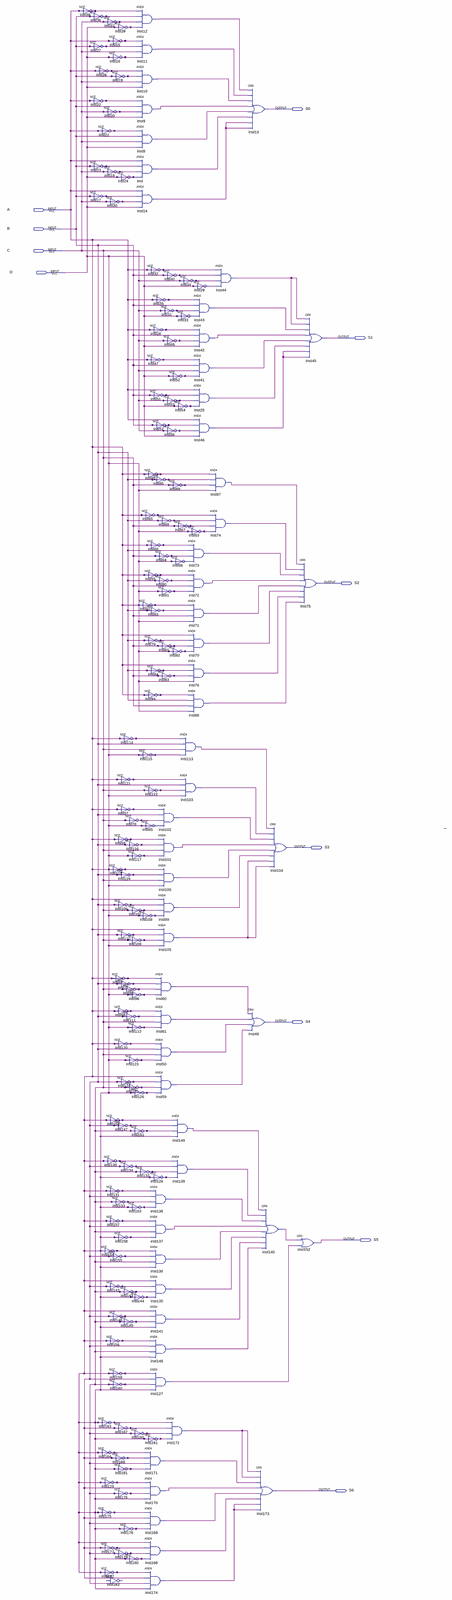
[diagram p0: schematic sheet, whole]
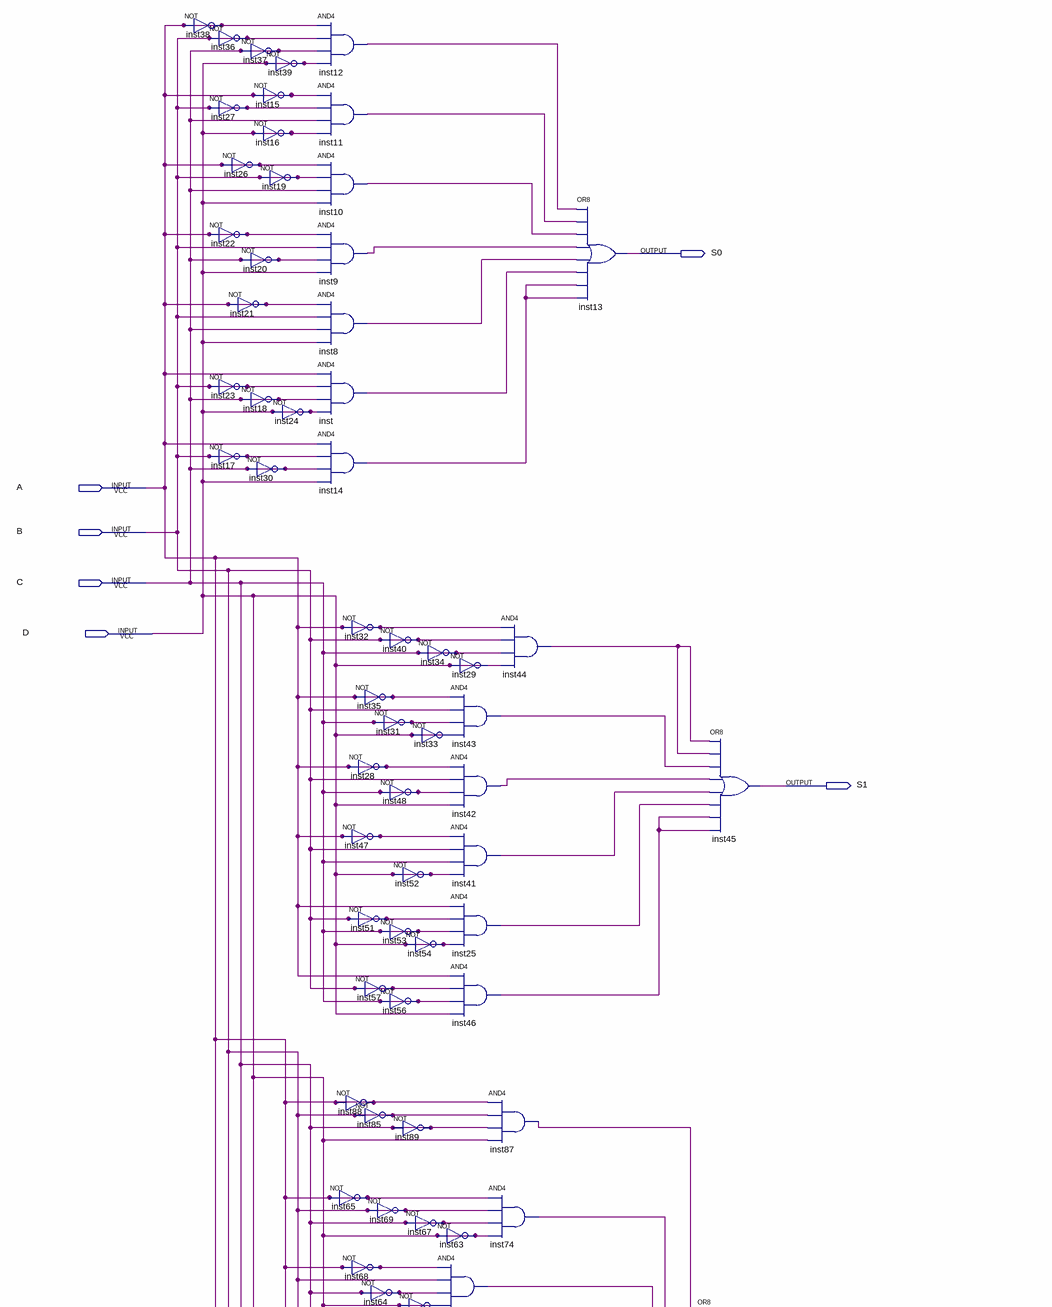
[diagram p1: schematic sheet, upper part]
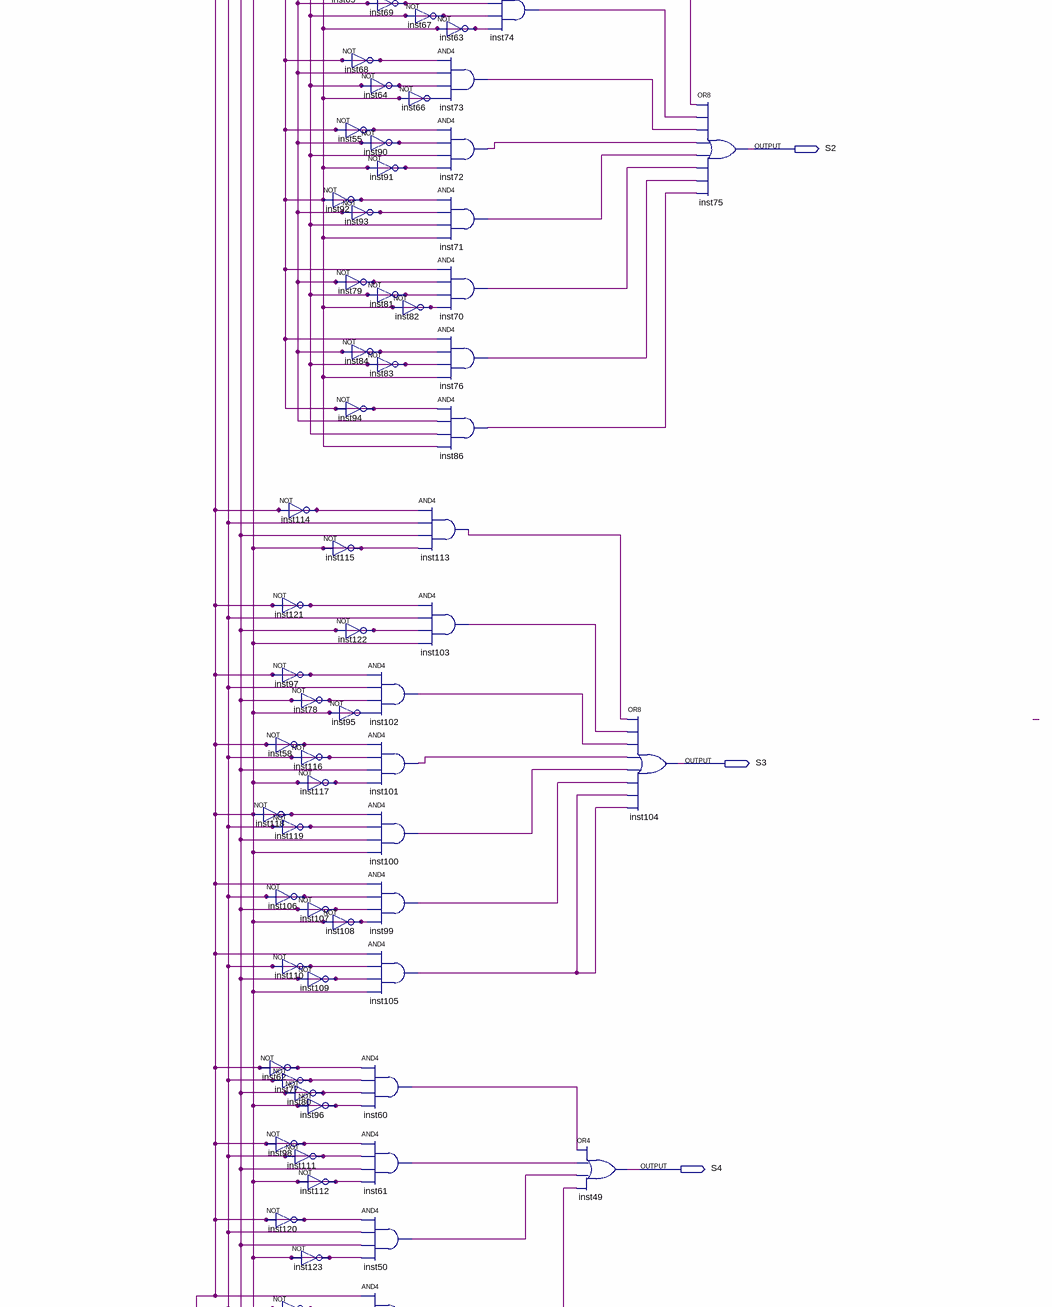
[diagram p2: schematic sheet, middle part]
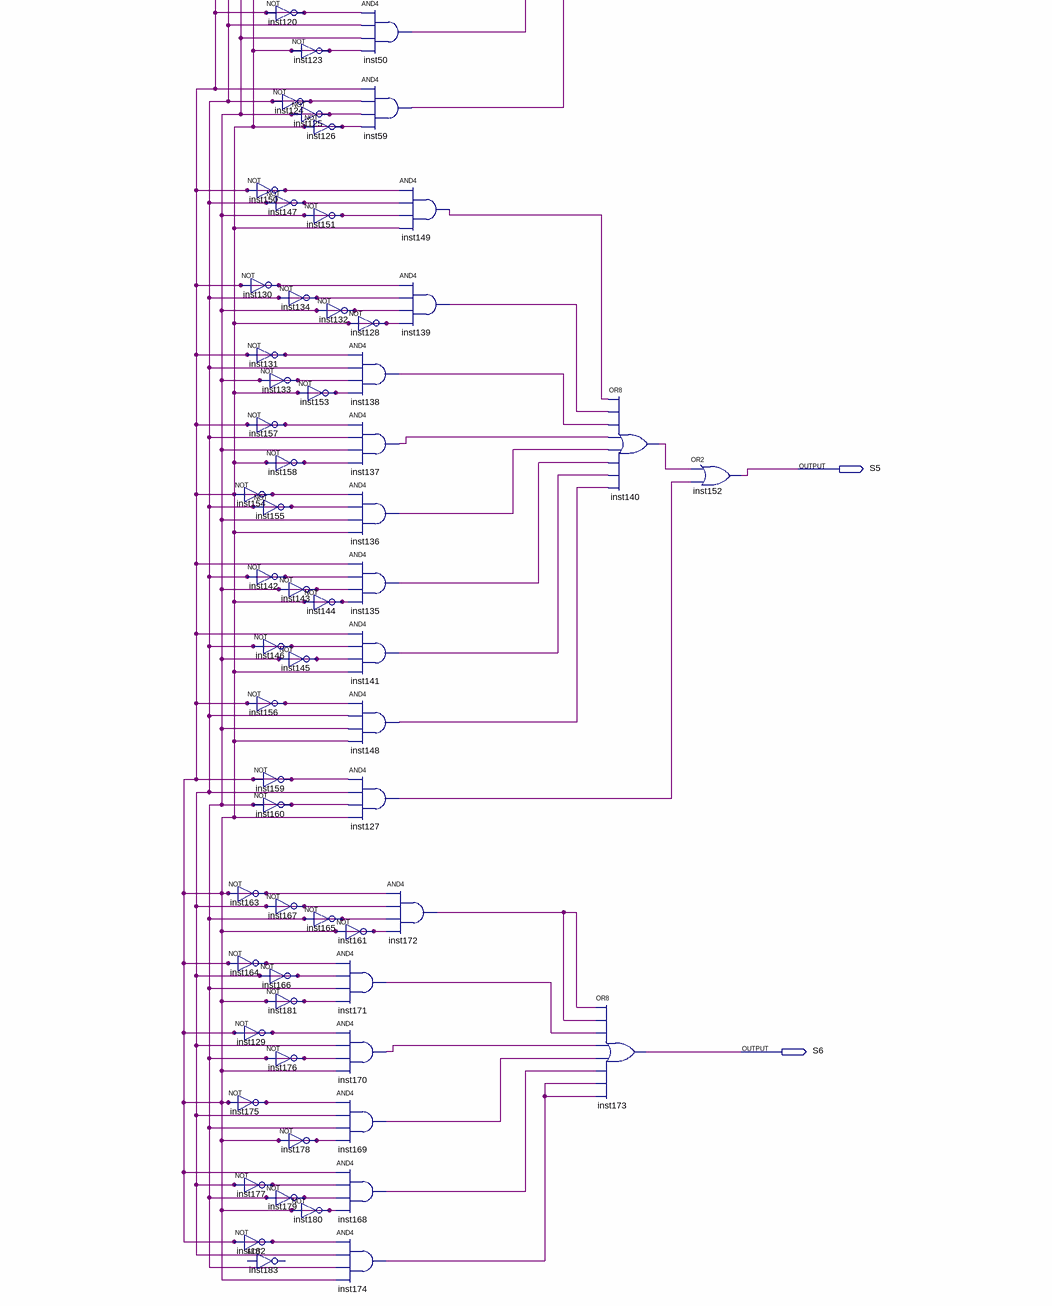
[diagram p3: schematic sheet, lower part]
// Quartus schematic Decodificador.bdf as structural Verilog: 176 symbols, 11 pins
module Decodificador (
  input  A,
  input  B,
  input  C,
  input  D,
  output S0,
  output S1,
  output S2,
  output S3,
  output S4,
  output S5,
  output S6
);

  wire inst8_out, inst9_out, inst10_out, inst11_out, inst12_out, inst14_out, inst25_out, inst41_out,
       inst42_out, inst43_out, inst44_out, inst46_out, inst50_out, inst59_out, inst60_out, inst61_out,
       inst70_out, inst71_out, inst72_out, inst73_out, inst74_out, inst76_out, inst86_out, inst87_out,
       inst99_out, inst100_out, inst101_out, inst102_out, inst103_out, inst105_out, inst113_out, inst127_out,
       inst135_out, inst136_out, inst137_out, inst138_out, inst139_out, inst140_out, inst141_out,
       inst148_out, inst149_out, inst168_out, inst169_out, inst170_out, inst171_out, inst172_out,
       inst174_out, inst_out;

  not inst38 (A, A);
  not inst36 (B, B);
  not inst27 (B, B);
  not inst22 (A, A);
  not inst23 (B, B);
  not inst17 (B, B);
  not inst37 (C, C);
  not inst39 (A, A);
  not inst15 (A, A);
  not inst16 (A, A);
  not inst26 (A, A);
  not inst19 (B, B);
  not inst20 (C, C);
  not inst21 (A, A);
  not inst18 (C, C);
  not inst30 (C, C);
  not inst58 (A, A);
  not inst118 (A, A);
  not inst106 (B, B);
  not inst62 (A, A);
  not inst98 (A, A);
  not inst120 (A, A);
  not inst150 (A, A);
  not inst147 (B, B);
  not inst130 (A, A);
  not inst131 (A, A);
  not inst133 (C, C);
  not inst157 (A, A);
  not inst158 (A, A);
  not inst154 (A, A);
  not inst155 (B, B);
  not inst142 (B, B);
  not inst146 (B, B);
  not inst156 (A, A);
  not inst159 (A, A);
  not inst160 (C, C);
  not inst163 (A, A);
  not inst167 (B, B);
  not inst164 (A, A);
  not inst166 (B, B);
  not inst181 (A, A);
  not inst129 (A, A);
  not inst176 (C, C);
  not inst175 (A, A);
  not inst177 (B, B);
  not inst179 (C, C);
  not inst182 (A, A);
  // NOT inst183 is placed but not wired
  and inst12 (inst12_out, A, B, C, A);
  and inst11 (inst11_out, A, B, C, A);
  and inst10 (inst10_out, A, B, C, A);
  and inst9 (inst9_out, A, B, C, A);
  and inst8 (inst8_out, A, B, C, A);
  and inst (inst_out, A, B, C, A);
  not inst24 (A, A);
  and inst14 (inst14_out, A, B, C, A);
  not inst114 (A, A);
  not inst121 (A, A);
  not inst97 (A, A);
  not inst78 (C, C);
  not inst116 (B, B);
  not inst117 (A, A);
  not inst119 (B, B);
  not inst107 (C, C);
  not inst110 (B, B);
  not inst109 (C, C);
  not inst77 (B, B);
  not inst80 (C, C);
  not inst96 (A, A);
  not inst111 (B, B);
  not inst112 (A, A);
  not inst123 (A, A);
  not inst124 (B, B);
  not inst125 (C, C);
  not inst126 (A, A);
  not inst151 (C, C);
  not inst134 (B, B);
  not inst132 (C, C);
  not inst153 (A, A);
  not inst143 (C, C);
  not inst144 (A, A);
  not inst145 (C, C);
  not inst165 (C, C);
  not inst178 (A, A);
  not inst180 (A, A);
  not inst32 (A, A);
  not inst35 (A, A);
  not inst28 (A, A);
  not inst47 (A, A);
  not inst51 (B, B);
  not inst57 (B, B);
  not inst88 (A, A);
  not inst85 (B, B);
  not inst65 (A, A);
  not inst69 (B, B);
  not inst68 (A, A);
  not inst64 (C, C);
  not inst55 (A, A);
  not inst90 (B, B);
  not inst91 (A, A);
  not inst92 (A, A);
  not inst93 (B, B);
  not inst79 (B, B);
  not inst81 (C, C);
  not inst84 (B, B);
  not inst83 (C, C);
  not inst94 (A, A);
  not inst115 (A, A);
  not inst122 (C, C);
  and inst102 (inst102_out, A, B, C, A);
  not inst95 (A, A);
  and inst101 (inst101_out, A, B, C, A);
  and inst100 (inst100_out, A, B, C, A);
  and inst99 (inst99_out, A, B, C, A);
  not inst108 (A, A);
  and inst105 (inst105_out, A, B, C, A);
  and inst60 (inst60_out, A, B, C, A);
  and inst61 (inst61_out, A, B, C, A);
  and inst50 (inst50_out, A, B, C, A);
  and inst59 (inst59_out, A, B, C, A);
  not inst128 (A, A);
  and inst138 (inst138_out, A, B, C, A);
  and inst137 (inst137_out, A, B, C, A);
  and inst136 (inst136_out, A, B, C, A);
  and inst135 (inst135_out, A, B, C, A);
  and inst141 (inst141_out, A, B, C, A);
  and inst148 (inst148_out, A, B, C, A);
  and inst127 (inst127_out, A, B, C, A);
  not inst161 (A, A);
  and inst171 (inst171_out, A, B, C, A);
  and inst170 (inst170_out, A, B, C, A);
  and inst169 (inst169_out, A, B, C, A);
  and inst168 (inst168_out, A, B, C, A);
  and inst174 (inst174_out, A, B, C, A);
  not inst40 (B, B);
  not inst34 (C, C);
  not inst31 (C, C);
  not inst33 (A, A);
  not inst48 (C, C);
  not inst52 (A, A);
  not inst53 (C, C);
  not inst54 (A, A);
  not inst56 (C, C);
  not inst89 (C, C);
  not inst67 (C, C);
  not inst66 (A, A);
  not inst82 (A, A);
  and inst113 (inst113_out, A, B, C, A);
  and inst103 (inst103_out, A, B, C, A);
  and inst149 (inst149_out, A, B, C, A);
  and inst139 (inst139_out, A, B, C, A);
  and inst172 (inst172_out, A, B, C, A);
  not inst29 (A, A);
  and inst43 (inst43_out, A, B, C, A);
  and inst42 (inst42_out, A, B, C, A);
  and inst41 (inst41_out, A, B, C, A);
  and inst25 (inst25_out, A, B, C, A);
  and inst46 (inst46_out, A, B, C, A);
  not inst63 (A, A);
  and inst73 (inst73_out, A, B, C, A);
  and inst72 (inst72_out, A, B, C, A);
  and inst71 (inst71_out, A, B, C, A);
  and inst70 (inst70_out, A, B, C, A);
  and inst76 (inst76_out, A, B, C, A);
  and inst86 (inst86_out, A, B, C, A);
  and inst44 (inst44_out, A, B, C, A);
  and inst87 (inst87_out, A, B, C, A);
  and inst74 (inst74_out, A, B, C, A);
  or inst13 (S0, inst12_out, inst11_out, inst10_out, inst9_out, inst8_out, inst_out, inst14_out, inst14_out);
  or inst49 (S4, inst60_out, inst61_out, inst50_out, inst59_out);
  or inst140 (inst140_out, inst149_out, inst139_out, inst138_out, inst137_out, inst136_out, inst135_out, inst141_out, inst148_out);
  or inst173 (S6, inst172_out, inst172_out, inst171_out, inst170_out, inst169_out, inst168_out, inst174_out, inst174_out);
  or inst104 (S3, inst113_out, inst103_out, inst102_out, inst101_out, inst100_out, inst99_out, inst105_out, inst105_out);
  or inst45 (S1, inst44_out, inst44_out, inst43_out, inst42_out, inst41_out, inst25_out, inst46_out, inst46_out);
  or inst75 (S2, inst87_out, inst74_out, inst73_out, inst72_out, inst71_out, inst70_out, inst76_out, inst86_out);
  or inst152 (S5, inst140_out, inst127_out);

  assign D = A;
endmodule
